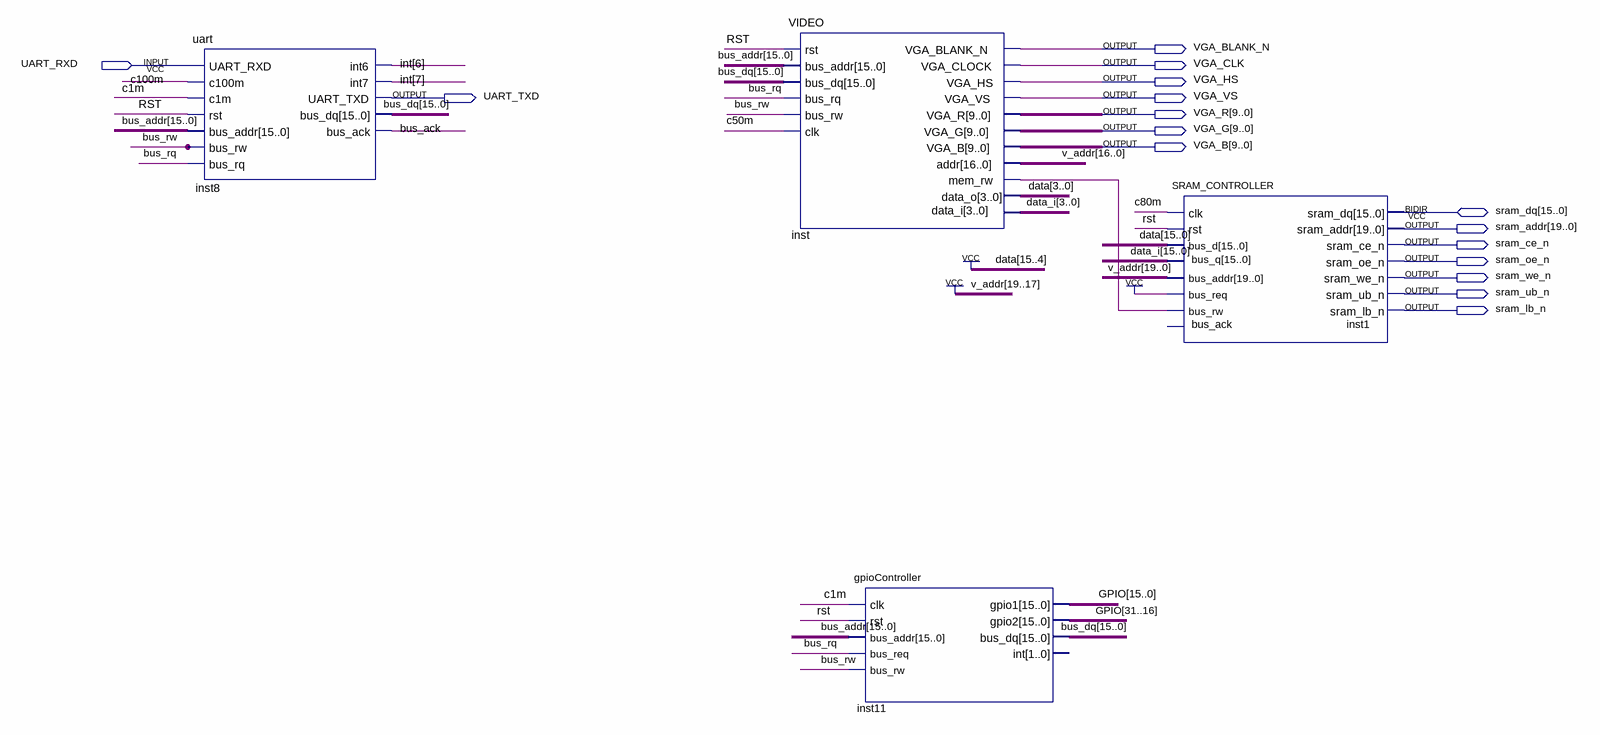
[diagram p0: schematic sheet]
// Quartus schematic IO.bdf as structural Verilog: 4 symbols, 16 pins
module IO (
  input  UART_RXD,
  inout  [15:0] sram_dq,
  output VGA_BLANK_N,
  output VGA_CLK,
  output VGA_HS,
  output UART_TXD,
  output VGA_VS,
  output [9:0] VGA_R,
  output [9:0] VGA_G,
  output [9:0] VGA_B,
  output [19:0] sram_addr,
  output sram_ce_n,
  output sram_oe_n,
  output sram_we_n,
  output sram_ub_n,
  output sram_lb_n
);

  wire bus_ack, bus_rq, bus_rw, c1m, c50m, c80m, c100m, inst_mem_rw, rst;
  wire [3:0] data;
  wire [7:6] \int ;
  wire [15:0] bus_addr, bus_dq, data_i;
  wire [16:0] v_addr;
  wire [31:0] GPIO;

  uart inst8 (
    .UART_RXD(UART_RXD), .c100m(c100m), .c1m(c1m), .rst(rst), .bus_addr(bus_addr), .bus_rw(bus_rw),
    .bus_rq(bus_rq), .int6(\int [6]), .int7(\int [7]), .UART_TXD(UART_TXD), .bus_dq(bus_dq), .bus_ack(bus_ack));
  VIDEO inst (
    .rst(rst), .bus_addr(bus_addr), .bus_dq(bus_dq), .bus_rq(bus_rq), .bus_rw(bus_rw), .data_i(data_i[3:0]),
    .clk(c50m), .VGA_BLANK_N(VGA_BLANK_N), .VGA_CLOCK(VGA_CLK), .VGA_HS(VGA_HS), .VGA_VS(VGA_VS),
    .VGA_R(VGA_R), .VGA_G(VGA_G), .VGA_B(VGA_B), .addr(v_addr), .mem_rw(inst_mem_rw), .data_o(data));
  gpioController inst11 (
    .clk(c1m), .rst(rst), .bus_addr(bus_addr), .bus_req(bus_rq), .bus_rw(bus_rw), .gpio1(GPIO[15:0]),
    .gpio2(GPIO[31:16]), .bus_dq(bus_dq));  // open: int
  SRAM_CONTROLLER inst1 (
    .clk(c80m), .rst(rst), .bus_d({{12{1'b1}}, data}), .bus_addr({3'b111, v_addr}), .bus_rw(inst_mem_rw),
    .bus_req(1'b1), .bus_q(data_i), .sram_addr(sram_addr), .sram_ce_n(sram_ce_n), .sram_oe_n(sram_oe_n),
    .sram_we_n(sram_we_n), .sram_ub_n(sram_ub_n), .sram_lb_n(sram_lb_n), .sram_dq(sram_dq));  // open: bus_ack
endmodule
